# EAGLE design sensorGateway (EAGLE 7.4.0)
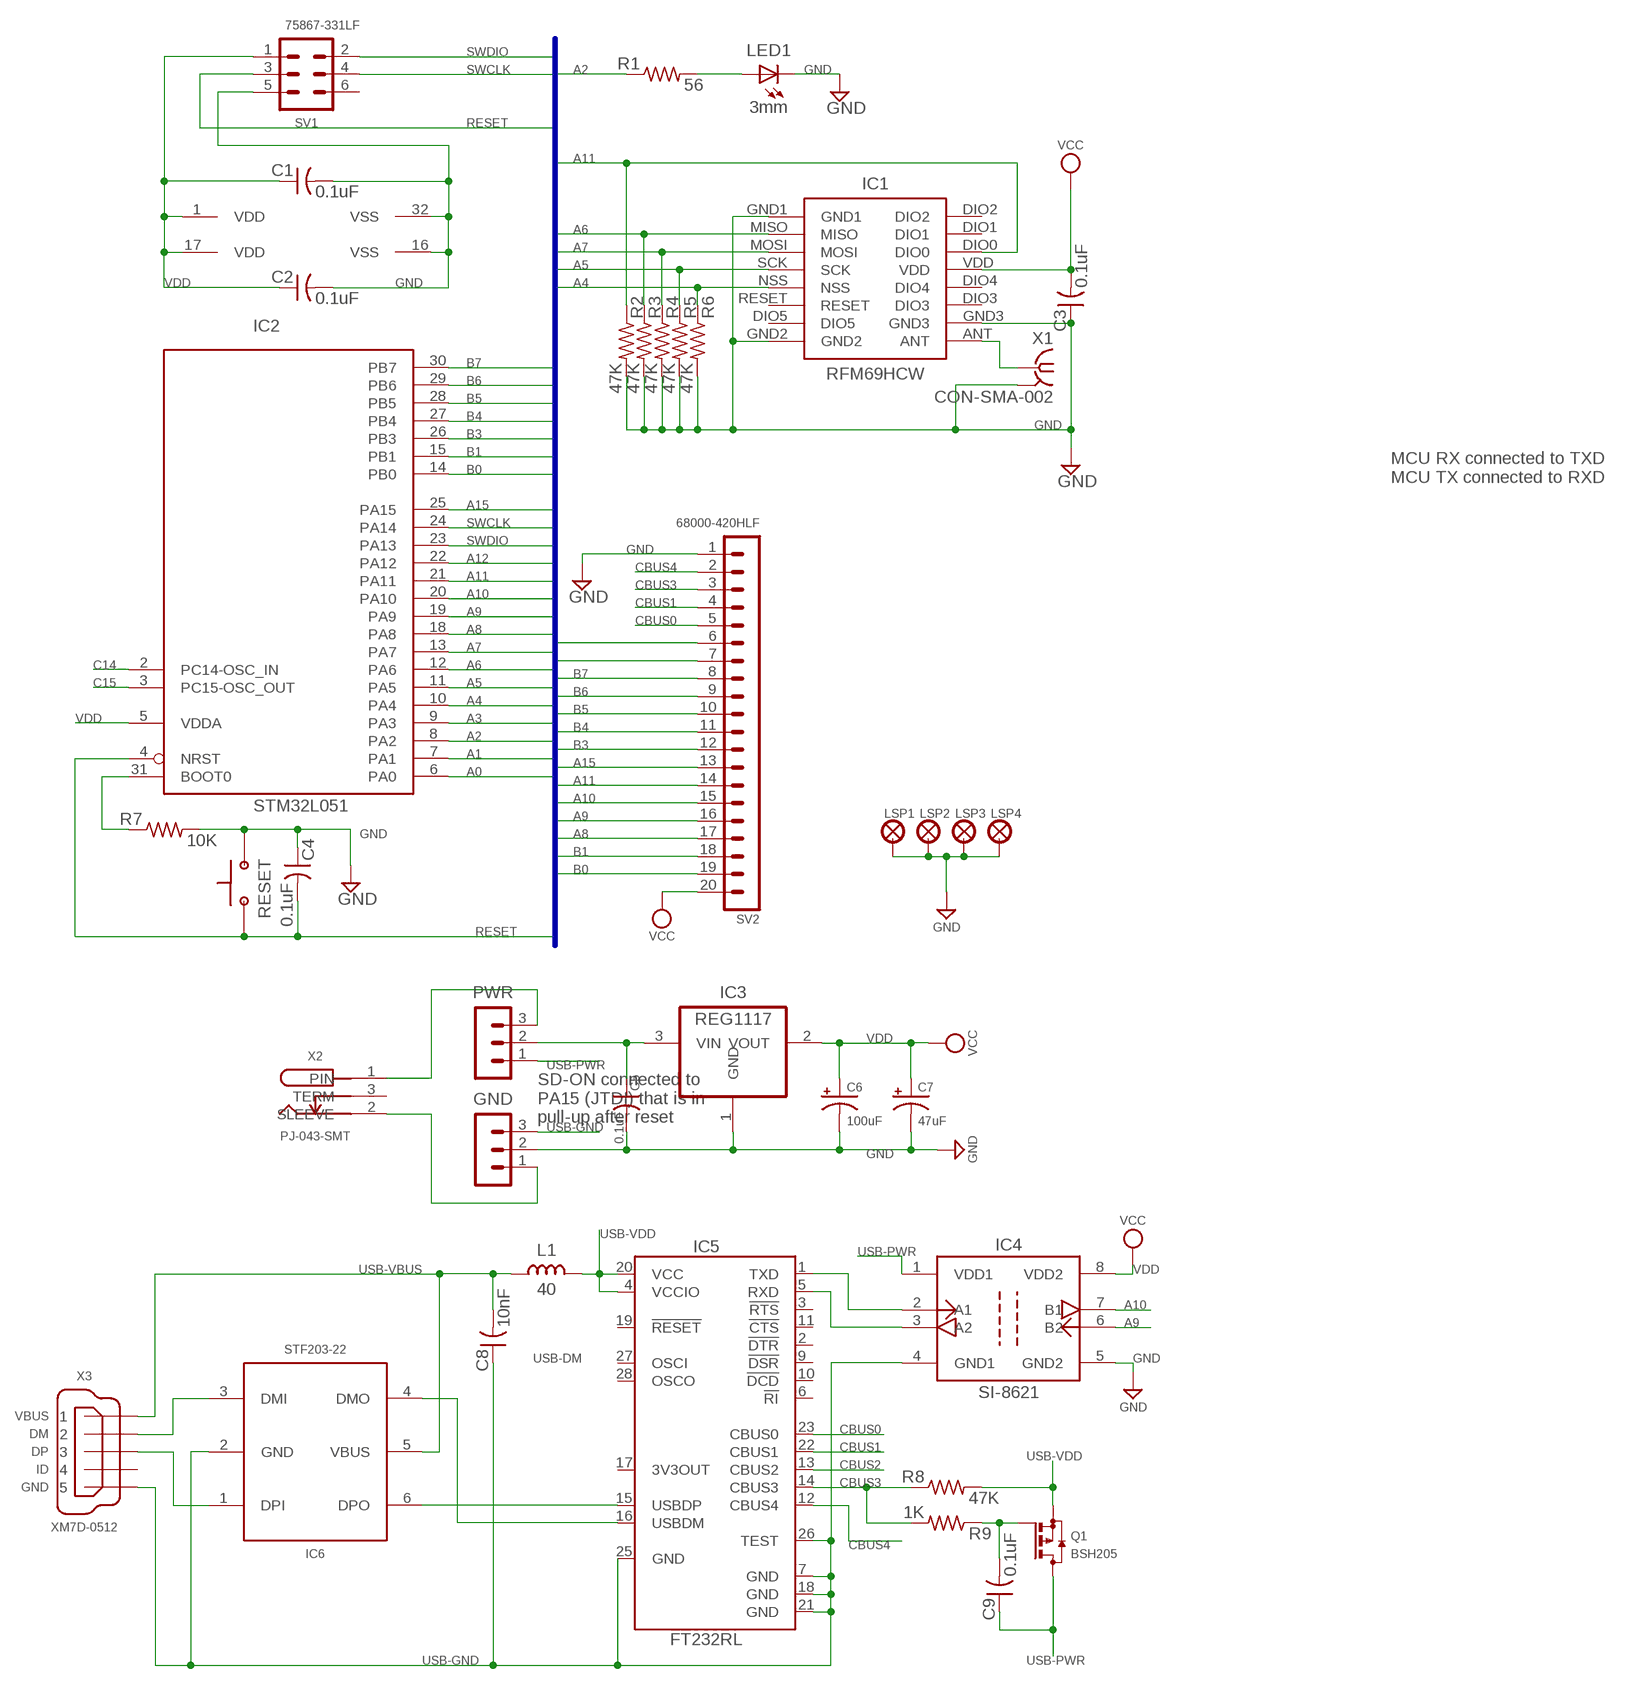
[diagram p0: schematic, sheet 1]

## Parts
C1  0.1uF  C-US0805  [C0805]
C2  0.1uF  C-US0805  [C0805]
C3  0.1uF  C-US0805  [C0805]
C4  0.1uF  C-US0805  [C0805]
C5  0.1uF  C-US0805  [C0805]
C6  100uF  CPOL-US1311  [CPOL1311]
C7  47uF  CPOL-US0805  [CPOL0805]
C8  10nF  C-US0805  [C0805]
C9  0.1uF  C-US0805  [C0805]
GND  MA03-1PL  [MA03-1]
IC1  RFM69HCW  [RFM69HCW]
IC2  STM32L051  STM32L051K8T  [LQFP32]
IC3  REG1117  [SOT223]
IC4  SI-8621  [SOIC-8]
IC5  FT232RL  [SSOP28]
IC6  STF203-22  [SC70-6]
L1  40  L-USL0805  [L0805]
LED1  3mm  LED3MM  [LED3MM]
LSP1  LSP27  [LSP27]
LSP2  LSP27  [LSP27]
LSP3  LSP27  [LSP27]
LSP4  LSP27  [LSP27]
PWR  MA03-1PL  [MA03-1]
Q1  BSH205  BSH205G2R  [SOT23]
R1  56  R-US0805  [R0805]
R2  47K  R-US0805  [R0805]
R3  47K  R-US0805  [R0805]
R4  47K  R-US0805  [R0805]
R5  47K  R-US0805  [R0805]
R6  47K  R-US0805  [R0805]
R7  10K  R-US0805  [R0805]
R8  47K  R-US0805  [R0805]
R9  1K  R-US0805  [R0805]
RESET  BUTTON-FSM14JRT  [BUTTON-FSM14JRT]
SV1  75867-331LF  MA03-2  [MA03-2]
SV2  68000-420HLF  MA20-1NO-PL  [MA20-1-NO-PL]
X1  CON-SMA-002  BU-SMA-G  [BU-SMA-G]
X2  PJ-043-SMT  DC-POWER-JACK2  [BUCHSE-1.0X3.2]
X3  XM7D-0512  MINI-USB-5-DPI  [XM7D-0512]

## Nets
A0: IC2.6(PA0)
A1: IC2.7(PA1)
A2: IC2.8(PA2) R1.1
A3: IC2.9(PA3)
A4: IC1.NSS IC2.10(PA4) R6.1
A5: IC1.SCK IC2.11(PA5) R5.1
A6: IC1.MISO IC2.12(PA6) R3.1
A7: IC1.MOSI IC2.13(PA7) R4.1
A8: IC2.18(PA8) SV2.17
A9: IC2.19(PA9) IC4.6(B2) SV2.16
A10: IC2.20(PA10) IC4.7(B1) SV2.15
A11: IC1.DIO0 IC2.21(PA11) R2.1 SV2.14
A12: IC2.22(PA12)
A15: IC2.25(PA15) SV2.13
A-BOOT: IC2.31(BOOT0) R7.1
B0: IC2.14(PB0) SV2.19
B1: IC2.15(PB1) SV2.18
B3: IC2.26(PB3) SV2.12
B4: IC2.27(PB4) SV2.11
B5: IC2.28(PB5) SV2.10
B6: IC2.29(PB6) SV2.9
B7: IC2.30(PB7) SV2.8
C14: IC2.2(PC14-OSC_IN) SV2.7
C15: IC2.3(PC15-OSC_OUT) SV2.6
CBUS0: IC5.23(CBUS0) SV2.5
CBUS1: IC5.22(CBUS1) SV2.4
CBUS2: IC5.13(CBUS2)
CBUS3: IC5.14(CBUS3) R8.1 R9.2 SV2.3
CBUS4: IC5.12(CBUS4) SV2.2
GND: C1.2 C2.2 C3.1 C4.1 C5.2 C6.2-(-) C7.2-(-) GND.2 IC1.GND1 IC1.GND2 IC1.GND3 IC2.16(VSS) IC2.32(VSS) IC3.1(GND) IC4.5(GND2) LED1.K(C) LSP1.MP LSP2.MP LSP3.MP LSP4.MP R2.2 R3.2 R4.2 R5.2 R6.2 R7.2 RESET.P$2 SV1.5 SV2.1 X1.2 X1.3 X1.4 X1.5
N$4: LED1.A R1.2
N$5: IC1.ANT X1.1
N$6: C9.2 Q1.1(G) R9.1
N$10: IC4.2(A1) IC5.1(TXD)
N$11: GND.1 X2.2(SLEEVE)
N$13: IC4.3(A2) IC5.5(RXD)
N$17: PWR.3 X2.1(PIN)
N$29: IC6.1(DPI) X3.3
N$36: IC6.3(DMI) X3.2
RESET: C4.2 IC2.4(NRST) RESET.P$1 SV1.3
SWCLK: IC2.24(PA14) SV1.4
SWDIO: IC2.23(PA13) SV1.2
USB-DM: IC5.16(USBDM) IC6.4(DMO)
USB-DP: IC5.15(USBDP) IC6.6(DPO)
USB-GND: C8.1 GND.3 IC4.4(GND1) IC5.7(GND) IC5.18(GND) IC5.21(GND) IC5.25(GND) IC5.26(TEST) IC6.2(GND) X3.5
USB-PWR: C9.1 IC4.1(VDD1) PWR.1 Q1.3(D)
USB-VBUS: C8.2 IC6.5(VBUS) L1.1 X3.1
USB-VDD: IC5.4(VCCIO) IC5.20(VCC) L1.2 Q1.2(S) R8.2
VDD: C1.1 C2.1 C3.2 C6.1+(+) C7.1+(+) IC1.VDD IC2.1(VDD) IC2.5(VDDA) IC2.17(VDD) IC3.2(VOUT) IC4.8(VDD2) SV1.1 SV2.20 ; supply symbol labelled VCC
VIN: C5.1 IC3.3(VIN) PWR.2
Unconnected: IC1.DIO1 IC1.DIO2 IC1.DIO3 IC1.DIO4 IC1.DIO5 IC1.RESET IC5.2(!DTR) IC5.3(!RTS) IC5.6(!RI) IC5.9(!DSR) IC5.10(!DCD) IC5.11(!CTS) IC5.17(3V3OUT) IC5.19(!RESET) IC5.27(OSCI) IC5.28(OSCO) SV1.6 X2.3(TERM) X3.4 X3.M1(S1) X3.M2(S2) X3.M3(S3) X3.M4(S4)

## Buses
A0,A1,A2,A3,A4,A5,A6,A7,A8,A9,A10,A11,A12,A13,A14,A15,B0,B1,B2,B3,B4,B5,B6,B7,C14,C15,RESET,SWDIO,SWCLK

## Notes on the sheet
- MCU RX connected to TXD
  MCU TX connected to RXD
- SD-ON connected to 
  PA15 (JTDI) that is in 
  pull-up after reset

## Library data of the parts
C1-C5 C8 C9 = MyComponents:C-US: SMD Multilayer Ceramic Capacitor; MOUSER: 80-C0805C104J5RAUTO
C6 = MyComponents:CPOL-US: SMT Tantalum Capacitor; MOUSER: 581-F951C476KBAAQ2
C7 = MyComponents:CPOL-US: SMT Tantalum Capacitor; MOUSER: 581-TAJR225K016RNJ
GND PWR = MyComponents:MA03-1: Headers & Wire Housing, 1 Row, 3 Position
IC1 = MyComponents:RFM69HCW: RFM69HCW transceiver module; MOUSER: 474-COM-13910
IC2 = stm32:STM32L051K*T: ARM 32-bit Cortex™-M0+ CPU 32 MHz maximum frequency 32 to 64 Kbytes of Flash memory 2 kbyte of Data EEPROM 8 kbytes of SRAM 27 GPIOs 1.8 to 3.6 V application supply; MOUSER: 511-STM32L051K8T6
IC3 = MyComponents:REG1117: 800mA and 1A Low Dropout (LDO) Positive Regulator 1.8V, 2.5V, 2.85V, 3.3V, 5V, and Adj; MOUSER: 511-LD1117S33
IC4 = MyComponents:SI-8621: Two channel ultra-low-power digital isolator; MOUSER: 634-SI8621AB-B-IS
IC5 = ftdichip:FT232R: Source: http://www.ftdichip.com/Documents/DataSheets/DS_FT232R_v104.pdf; MOUSER: 895-FT232RL
IC6 = MyComponents:STF203: USB EMI filtering and ESD protection; MOUSER: 947-STF203-22.TCT
L1 = MyComponents:L-US: SMD Ferrite Bead; MOUSER: 963-CKP2012N1R0M-T
LED1 = led:LED: LED OSRAM: - CHIPLED LG R971, LG N971, LY N971, LG Q971, LY Q971, LO R971, LY R971 LH N974, LH R974 LS Q976, LO Q976, LY Q976 LO Q996 - Hyper CHIPLED LW Q18S LB Q993, LB Q99A, LB R99A - SideLED LS A670, LO A670, LY A670, LG A670, LP A670 LB A673, LV A673, LT A673, LW A673 LH A674 LY A675 LS A676, LA A676, LO A676, LY A676, LW A676 LS A679, LY A679, LG A679 - Hyper Micro SIDELED® LS Y876, LA Y876, LO Y876, LY Y876 LT Y87S - SmartLED LW L88C, LW L88S LB L89C, LB L89S, LG L890 LS L89K, LO L89K, LY L89K LS L896, LA L896, LO L896, LY L896 - TOPLED LS T670, LO T670, LY T670, LG T670, LP T670 LSG T670, LSP T670, LSY T670, LOP T670, LYG T670 LG T671, LOG T671, LSG T671 LB T673, LV T673, LT T673, LW T673 LH T674 LS T676, LA T676, LO T676, LY T676, LB T676, LH T676, LSB T676, LW T676 LB T67C, LV T67C, LT T67C, LS T67K, LO T67K, LY T67K, LW E67C LS E67B, LA E67B, LO E67B, LY E67B, LB E67C, LV E67C, LT E67C LW T67C LS T679, LY T679, LG T679 LS T770, LO T770, LY T770, LG T770, LP T770 LB T773, LV T773, LT T773, LW T773 LH T774 LS E675, LA E675, LY E675, LS T675 LS T776, LA T776, LO T776, LY T776, LB T776 LHGB T686 LT T68C, LB T68C - Hyper Mini TOPLED® LB M676 - Mini TOPLED Santana® LG M470 LS M47K, LO M47K, LY M47K Source: http://www.osram.convergy.de LUXEON: - LUMILED® LXK2-PW12-R00, LXK2-PW12-S00, LXK2-PW14-U00, LXK2-PW14-V00 LXK2-PM12-R00, LXK2-PM12-S00, LXK2-PM14-U00 LXK2-PE12-Q00, LXK2-PE12-R00, LXK2-PE12-S00, LXK2-PE14-T00, LXK2-PE14-U00 LXK2-PB12-K00, LXK2-PB12-L00, LXK2-PB12-M00, LXK2-PB14-N00, LXK2-PB14-P00, LXK2-PB14-Q00 LXK2-PR12-L00, LXK2-PR12-M00, LXK2-PR14-Q00, LXK2-PR14-R00 LXK2-PD12-Q00, LXK2-PD12-R00, LXK2-PD12-S00 LXK2-PH12-R00, LXK2-PH12-S00 LXK2-PL12-P00, LXK2-PL12-Q00, LXK2-PL12-R00 Source: www.luxeon.com KINGBRIGHT: KA-3528ASYC Source: www.kingbright.com
LSP1-LSP4 = MyComponents:LSP27: Solder Pad, drill 2.75 mm
Q1 = MyComponents:BSH205G2R: P-channel enhancement mode MOSFET (-2.3A); MOUSER: 771-BSH205G2R
R1-R9 = MyComponents:R-US: SMD Resistor; MOUSER: 660-RK73H2ATTDD1R00F
RESET = MyComponents:BUTTON-FSM14JRT: TE Connectivity / Alcoswitch Round Switch; MOUSER: 506-1571010-1
SV1 = MyComponents:MA03-2: Headers & Wire Housing, 2 Row, 6 Position; MOUSER: 68602-406HLF
SV2 = MyComponents:MA20-1: Headers & Wire Housing, 1 Row, 20 Position; MOUSER: 649-68000-420HLF
X1 = MyComponents:BU-SMA-G: FEMALE SMA CONNECTOR Radiall distributor RS 193-9117; MOUSER: 712-CONSMA002
X2 = MyComponents:DC-POWER-JACK: DC Power Connector 1 mm X 3.2 mm; MOUSER: 490-PJ-043-SMT-TR
X3 = MyComponents:MINI-USB-5-DPI: Mini USB Type B Connector; MOUSER: 653-XM7D-0512

## Board
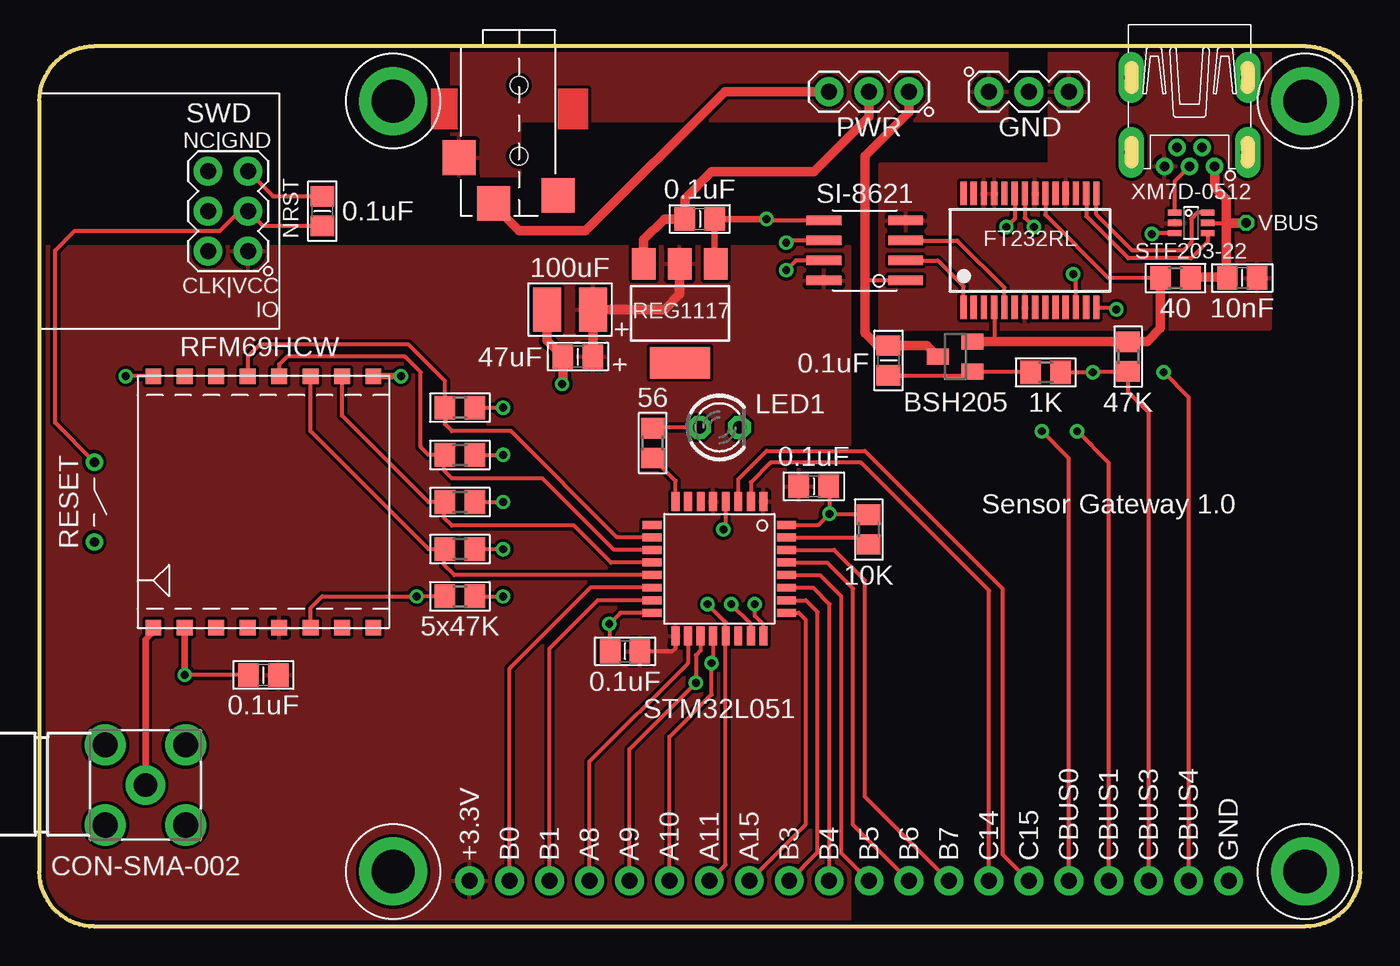
[diagram p1: board, top side]
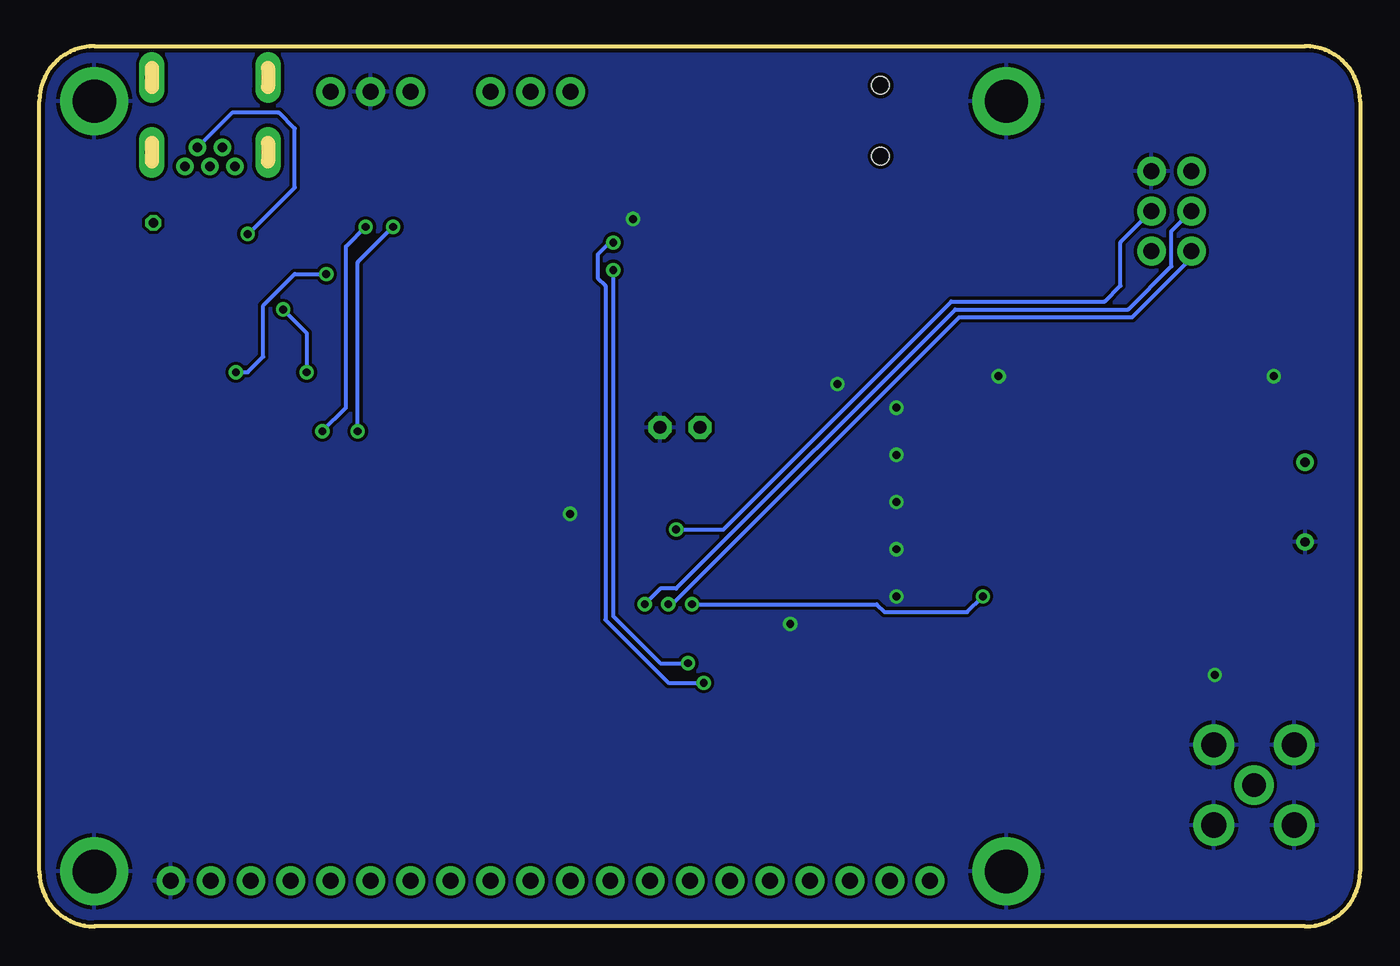
[diagram p2: board, bottom side, seen from below]

Size 84 x 56 mm. Coordinates in mm from the lower left corner, seen from the top.
Outline: 84,3.5 84,52.5 arc90 80.5,56 3.5,56 arc90 0,52.5 0,3.5 arc90 3.5,0 80.5,0 arc90 84,3.5
Copper layers (1*16): Top 0.035mm / dielectric 1.5mm / Bottom 0.035mm
Design rules "eagle *": minimum track width 10mil, minimum drill 19mil, track to track 8mil, track to pad 8mil, pad to pad 7mil, via to via 12mil, smd to smd 7mil, copper to edge 10mil, drill to drill 30mil, minimum pad ring 10mil, minimum via ring 8mil, stop-mask expansion 4mil, vias tented up to drill 0mil, thermal gap 10mil

### Footprints (pad centres in the part's own frame; a part is rotated, then mirrored left to right if it is on the bottom)
C0805 = smd 1.3 x 1.5: 1 -0.95,0; 2 0.95,0
CPOL1311 = smd 1.778 x 2.794: 1+ -1.462,0; 2- 1.462,0
CPOL0805 = smd 1.3 x 1.5: 1+ -0.95,0; 2- 0.95,0
MA03-1 = drill 1.016: 1 -2.54,0; 2 0,0; 3 2.54,0
RFM69HCW = smd 1 x 1: ANT 8,-7; DIO0 8,3; DIO1 8,5; DIO2 8,7; DIO3 8,-3; DIO4 8,-1; DIO5 -8,-5; GND1 -8,7; GND2 -8,-7; GND3 8,-5; MISO -8,5; MOSI -8,3; NSS -8,-1; RESET -8,-3; SCK -8,1; VDD 8,1
LQFP32 = smd 0.5 x 1.2: 1 -2.8,-4.275; 2 -2,-4.275; 3 -1.2,-4.275; 4 -0.4,-4.275; 5 0.4,-4.275; 6 1.19,-4.275; 7 1.99,-4.275; 8 2.79,-4.275; 17 2.8,4.275; 18 2,4.275; 19 1.2,4.275; 20 0.4,4.275; 21 -0.4,4.275; 22 -1.2,4.275; 23 -2,4.275; 24 -2.8,4.275 | smd 1.2 x 0.5: 9 4.275,-2.8; 10 4.275,-2; 11 4.275,-1.2; 12 4.275,-0.4; 13 4.275,0.4; 14 4.275,1.2; 15 4.275,2; 16 4.275,2.8; 25 -4.275,2.8; 26 -4.275,2; 27 -4.275,1.2; 28 -4.275,0.4; 29 -4.275,-0.4; 30 -4.275,-1.2; 31 -4.275,-2; 32 -4.275,-2.8
SOT223 = smd 1.499 x 2.007: 1 -2.261,-3.15; 2 0.025,-3.15; 3 2.311,-3.15 | smd 3.81 x 2.007: 4 0,3.15
SOIC-8 = smd 0.6 x 2.2: 1 -1.905,-2.6; 2 -0.635,-2.6; 3 0.635,-2.6; 4 1.905,-2.6; 5 1.905,2.6; 6 0.635,2.6; 7 -0.635,2.6; 8 -1.905,2.6
SSOP28 = smd 0.4 x 1.5: 1 -4.225,-3.625; 2 -3.575,-3.625; 3 -2.925,-3.625; 4 -2.275,-3.625; 5 -1.625,-3.625; 6 -0.975,-3.625; 7 -0.325,-3.625; 8 0.325,-3.625; 9 0.975,-3.625; 10 1.625,-3.625; 11 2.275,-3.625; 12 2.925,-3.625; 13 3.575,-3.625; 14 4.225,-3.625; 15 4.225,3.625; 16 3.575,3.625; 17 2.925,3.625; 18 2.275,3.625; 19 1.625,3.625; 20 0.975,3.625; 21 0.325,3.625; 22 -0.325,3.625; 23 -0.975,3.625; 24 -1.625,3.625; 25 -2.275,3.625; 26 -2.925,3.625; 27 -3.575,3.625; 28 -4.225,3.625
SC70-6 = smd 0.4 x 0.85: 1 -0.65,-1.05; 2 0,-1.05; 3 0.65,-1.05; 4 0.65,1.05; 5 0,1.05; 6 -0.65,1.05
L0805 = smd 1.3 x 1.5: 1 -0.95,0; 2 0.95,0
LED3MM = drill 0.813 octagon: A -1.27,0; K 1.27,0
LSP27 = drill 2.75 pad 4.318: MP 0,0
SOT23 = smd 1 x 1.4: 1 -0.95,-1.1; 2 0.95,-1.1; 3 0,1.1
R0805 = smd 1.3 x 1.5: 1 -0.95,0; 2 0.95,0
BUTTON-FSM14JRT = drill 0.6: P$1 -2.54,0; P$2 2.54,0
MA03-2 = drill 1.016: 1 -2.54,-1.27; 2 -2.54,1.27; 3 0,-1.27; 4 0,1.27; 5 2.54,-1.27; 6 2.54,1.27
MA20-1-NO-PL = drill 1.016: 1 -24.13,0; 2 -21.59,0; 3 -19.05,0; 4 -16.51,0; 5 -13.97,0; 6 -11.43,0; 7 -8.89,0; 8 -6.35,0; 9 -3.81,0; 10 -1.27,0; 11 1.27,0; 12 3.81,0; 13 6.35,0; 14 8.89,0; 15 11.43,0; 16 13.97,0; 17 16.51,0; 18 19.05,0; 19 21.59,0; 20 24.13,0
BU-SMA-G = drill 1.5: 1 0,0 | drill 1.6: 2 -2.55,2.55; 3 2.55,2.55; 4 2.55,-2.55; 5 -2.55,-2.55
BUCHSE-1.0X3.2 = smd 2.2 x 2.1: 1 10,-1.6; 2 7.1,-3.8; 3 9.5,2.5 | hole 1.1: 7,0; 2.5,0
XM7D-0512 = drill 0.6 pad 1.016: 1 1.6,-0.9; 2 0.8,0.3; 3 0,-0.9; 4 -0.8,0.3; 5 -1.6,-0.9 | drill 0.9 pad 1.422 long: M1 3.7,4.75; M2 -3.7,4.75; M3 -3.7,0; M4 3.7,0

### Placement (x,y rotation side)
C1  49.25,28 0 top
C2  37.25,17.5 180 top
C3  14.25,16 0 top
C4  18,45.5 270 top
C5  42,45 0 top
C6  33.75,39.25 180 top
C7  34.25,36.25 180 top
C8  76.5,41.25 180 top
C9  54,36 270 top
GND  62.93,53.1 0 top
IC1  14.25,27 270 top
IC2  43.25,22.75 180 top
IC3  40.75,39 180 top
IC4  52.5,43 90 top
IC5  63,43 0 top
IC6  73.25,44.75 270 top
L1  72.25,41.25 180 top
LED1  43.25,31.75 0 top
LSP1  80.5,3.5 90 top
LSP2  80.5,52.5 90 top
LSP3  22.5,3.5 90 top
LSP4  22.5,52.5 90 top
PWR  52.76,53.1 180 top
Q1  58.25,36.25 90 top
R1  39,30.75 90 top
R2  26.75,21 0 top
R3  26.75,27 0 top
R4  26.75,24 0 top
R5  26.75,30 0 top
R6  26.75,33 0 top
R7  52.75,25.25 90 top
R8  69.25,36.25 90 top
R9  64,35.25 0 top
RESET  3.5,27 270 top
SV1  12,45.5 90 top
SV2  51.5,2.9 180 top
X1  6.75,9 180 top
X2  30.5,56 270 top
X3  73.15,49.25 0 top

### Tracks (layer width: path | path; a pad name or v marks a point on that pad's centre or on a via)
A2
  Top 0.254: IC2.8 40.46,28.34 R1.1
A4
  Top 0.254: IC2.10 36.75,24.75 30,31.5 26.25,31.5 25.8,31.95 R6.1 25.8,34.7 23.5,37 14,37 13.25,36.25 IC1.NSS
A5
  Top 0.254: IC2.11 36.55,23.95 32,28.5 26.25,28.5 25.75,29 25.75,29.95 R5.1 24.75,30 24.25,30.5 24.25,35.25 23.25,36.25 15.75,36.25 15.25,35.75 IC1.SCK
A6
  Top 0.254: IC2.12 36.35,23.15 34,25.5 26.25,25.5 25.75,26 25.75,26.95 R3.1 24.75,27 19.25,32.5 IC1.MISO
A7
  Top 0.254: IC2.13 26.4,22.35 25.75,23 25.75,23.95 R4.1 24.75,24 17.25,31.5 IC1.MOSI
A8
  Top 0.254: SV2.17 34.99,10.49 41.25,16.75 IC2.18
A9  (via drill 0.5)
  Top 0.254: IC4.6 47.63,43.63 v47.5,43.5 | IC2.19 42.05,17.55 41.75,17.25 v41.75,15.5 37.53,11.28 SV2.16
  Bottom 0.254: v47.5,43.5 47.75,43.5 48.5,42.75 48.5,41.25 48,40.75 48,19.5 44,15.5 v41.75,15.5
A10  (via drill 0.5)
  Top 0.254: IC4.7 48.12,42.37 v47.5,41.75 | IC2.20 42.85,16.85 v42.75,16.75 42.75,14.75 40.07,12.07 SV2.15
  Bottom 0.254: v47.5,41.75 47.5,19.75 44.5,16.75 v42.75,16.75
A11  (via drill 0.5)
  Top 0.254: IC1.DIO0 17.25,20.25 18,21 v24,21 R2.1 | v42.5,20.5 43.65,19.35 IC2.21 43.65,3.94 SV2.14
  Bottom 0.254: v42.5,20.5 30.75,20.5 30.25,20 25,20 v24,21
A15
  Top 0.254: SV2.13 48.75,6.5 48.75,19.5 48.3,19.95 IC2.25
A-BOOT
  Top 0.254: IC2.31 52.3,24.75 R7.1
B0
  Top 0.254: SV2.19 29.91,16.41 35.05,21.55 IC2.14
B1
  Top 0.254: SV2.18 32.45,17.7 35.5,20.75 IC2.15
B3
  Top 0.254: SV2.12 49.5,4.71 49.5,20 48.75,20.75 IC2.26
B4
  Top 0.254: SV2.11 50.25,2.92 50.25,20.5 49.2,21.55 IC2.27
B5
  Top 0.254: SV2.10 51,4.67 51,21 49.65,22.35 IC2.28
B6
  Top 0.254: SV2.9 51.75,6.46 51.75,21.5 50.1,23.15 IC2.29
B7
  Top 0.254: SV2.8 52.5,8.25 52.5,22 50.55,23.95 IC2.30
C14
  Top 0.254: SV2.7 60.39,21.36 52.25,29.5 46.5,29.5 45.25,28.25 IC2.2
C15
  Top 0.254: IC2.3 44.45,28.45 46.25,30.25 52.5,30.25 61.25,21.5 61.25,4.58 SV2.6
CBUS0  (via drill 0.5)
  Top 0.254: SV2.5 65.47,29.78 v63.75,31.5 | IC5.23 62.02,45.02 v61.5,44.5
  Bottom 0.254: v63.75,31.5 63.75,42.25 v61.5,44.5
CBUS1  (via drill 0.5)
  Top 0.254: SV2.4 68.01,29.49 v66,31.5 | IC5.22 62.67,45.08 v63.25,44.5
  Bottom 0.254: v66,31.5 64.5,33 64.5,43.25 v63.25,44.5
CBUS3  (via drill 0.5)
  Top 0.254: IC5.14 68.38,39.38 v68.5,39.25 | R9.2 v67,35.25 69.2,35.25 | SV2.3 70.55,32.7 69.25,34 R8.1
  Top 0.406: R8.1 69.2,35.25
  Bottom 0.254: v68.5,39.25 67,37.75 v67,35.25
CBUS4  (via drill 0.5)
  Top 0.254: IC5.12 65.92,41.33 v65.75,41.5 | SV2.2 73.09,33.66 v71.5,35.25
  Bottom 0.254: v71.5,35.25 70.75,35.25 69.75,36.25 69.75,39.5 67.75,41.5 v65.75,41.5
GND  (via drill 0.5)
  Top 0.254: IC4.5 46.34,44.91 v46.25,45 | R2.2 v29.5,21 | R4.2 v29.5,24 | R3.2 v29.5,27 | R5.2 v29.5,30 | R6.2 v29.5,33 | C2.2 36.3,19.2 v36.25,19.25 36.95,19.95 IC2.16 | 50.2,26.3 v50.25,26.25 | IC2.32 49.55,25.55 v50.25,26.25 | C1.2 50.25,27.95 v50.25,26.25 | C3.1 v9.25,16 | SV1.5 14.86,46.45 C4.1 | IC1.GND2 v5.5,35 | v50.25,26.25 52.7,26.25 R7.2
  Top 0.406: v46.25,45 C5.2 42.95,42.21 IC3.1 | IC1.GND3 v9.25,16 | IC1.GND1 v23,35
  Top 0.61: C6.2- 32.29,37.26 C7.2- 33.3,34.55 v33.25,34.5
  pour Bottom: 0,56 0,0 84,0 84,56
N$4
  Top 0.254: LED1.A 39.05,31.75 R1.2
N$5
  Top 0.406: X1.1 6.75,18.25 7.25,18.75 IC1.ANT
N$6
  Top 0.254: R9.1 59.4,35.25 Q1.1 59.1,35.05 C9.2
N$10
  Top 0.254: IC4.2 57.13,42.37 58.77,40.73 IC5.1
N$11
  pour Top: 61.5,56 61.5,51.25 30.5,51.25 30.5,47.75 26.25,47.75 26.25,56
N$13
  Top 0.254: IC4.3 58.37,43.63 61.38,40.62 IC5.5
N$17
  Top 0.61: X2.1 28.9,45.85 30.5,44.25 34.75,44.25 43.6,53.1 PWR.3
N$29
  Top 0.254: IC6.1 72.2,47.4 X3.3
N$36  (via drill 0.5)
  Top 0.254: IC6.3 70.8,44.1 v70.75,44.05
  Bottom 0.254: X3.2 71.75,51.75 68.75,51.75 67.75,50.75 67.75,47 70.6,44.15 70.65,44.15 v70.75,44.05
RESET  (via drill 0.5)
  Top 0.254: IC2.4 43.65,25.4 v43.5,25.25 | C4.2 14.22,44.55 SV1.3 12.75,45.5 11.5,44.25 2.25,44.25 1,43 1,32.04 RESET.P$1
  Bottom 0.254: v43.5,25.25 40.5,25.25 26,39.75 16.25,39.75 15.25,40.75 15.25,43.52 SV1.3
SWCLK  (via drill 0.5)
  Top 0.254: IC2.24 46.05,19.2 45.5,19.75 v45.5,20.5
  Bottom 0.254: SV1.4 12,44.23 12,42 14.75,39.25 25.75,39.25 43.5,21.5 44.5,21.5 v45.5,20.5
SWDIO  (via drill 0.5)
  Top 0.254: IC2.23 45.25,19.25 v44,20.5
  Bottom 0.254: v44,20.5 43.75,20.5 25.5,38.75 14.5,38.75 10.75,42.5 10.75,42.94 SV1.2
USB-DM
  Top 0.254: IC6.4 74.3,43.55 73.25,42.5 69.25,42.5 66.58,45.17 IC5.16
USB-DP
  Top 0.254: IC6.6 73.65,45.4 73.25,45 73.25,43.5 72.75,43 69.5,43 67.22,45.27 IC5.15
USB-GND
  pour Top: 78.25,56 78.25,38 53.5,38 53.5,48.5 64.25,48.5 64.25,56
USB-PWR
  Top 0.254: IC4.1 52.59,41.09 52.5,41
  Top 0.406: C9.1 53.3,36.95
  Top 0.61: Q1.3 56.45,36.95 C9.1 | 53.3,36.95 52.5,37.75 52.5,41 52.5,49 55.3,51.8 PWR.1
USB-VBUS  (via drill 0.6)
  Top 0.254: IC6.5 75.5,44.75
  Top 0.406: 75.5,41.3 C8.2 | 73.25,41.3 L1.1
  Top 0.61: 75.5,44.75 75.5,41.3 73.25,41.3 | X3.1 74.75,47 75.5,46.25 75.5,44.75 | 75.5,44.75 v76.75,44.75
USB-VDD
  Top 0.254: L1.2 68,41.25 63.98,45.27 IC5.20 | IC5.4 60.75,39.35 60.75,37.2
  Top 0.61: L1.2 71.3,38.05 70.45,37.2 R8.2 60.75,37.2 Q1.2
VDD
  Top 0.254: IC2.17 40.45,17.7 40.25,17.5 C2.1
  Top 0.61: IC3.2 40.73,40.23 39.75,39.25 C6.1+ 35.21,36.26 C7.1+
  pour Top: 0,43.25 51.5,43.25 51.5,0 0,0
VIN
  Top 0.61: PWR.2 52.76,51.51 49.25,48 42.75,48 41.05,46.3 C5.1 39.75,45 38.44,43.69 IC3.3

### Text on the board
tNames: SWD | NC|GND | VBUS | NRST | CLK|VCC / IO | Sensor Gateway 1.0 | 5x47K | +3.3V | B0 | B1 | A8 | A9 | A10 | A11 | A15 | B3 | B4 | B5 | B6 | B7 | C14 | C15 | CBUS0 | CBUS1 | CBUS3 | CBUS4 | GND